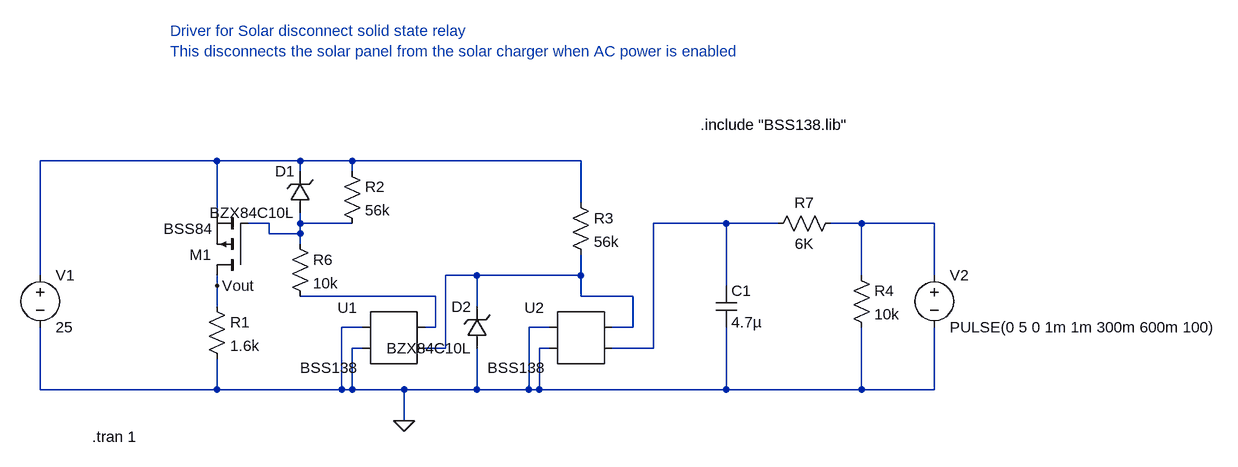
[diagram p0: schematic ndo-solar-switch.asc]
ndo-solar-switch.asc, the LTspice schematic file:
Version 4
SHEET 1 1392 768
WIRE -176 80 -448 80
WIRE -48 80 -176 80
WIRE 32 80 -48 80
WIRE 384 80 32 80
WIRE -48 96 -48 80
WIRE 32 96 32 80
WIRE 384 144 384 80
WIRE -176 160 -176 80
WIRE -96 176 -128 176
WIRE -48 176 -48 160
WIRE 32 176 -48 176
WIRE 608 176 496 176
WIRE 688 176 608 176
WIRE 816 176 768 176
WIRE 928 176 816 176
WIRE -96 192 -96 176
WIRE -48 192 -48 176
WIRE -48 192 -96 192
WIRE -48 208 -48 192
WIRE -448 256 -448 80
WIRE 224 256 176 256
WIRE 384 256 384 224
WIRE 384 256 224 256
WIRE 816 256 816 176
WIRE 928 256 928 176
WIRE -176 272 -176 256
WIRE 608 272 608 176
WIRE 160 288 -48 288
WIRE 384 288 384 256
WIRE 464 288 384 288
WIRE -176 304 -176 272
WIRE 224 304 224 256
WIRE 48 336 16 336
WIRE 160 336 160 288
WIRE 160 336 144 336
WIRE 336 336 304 336
WIRE 464 336 464 288
WIRE 464 336 432 336
WIRE 48 368 32 368
WIRE 176 368 176 256
WIRE 176 368 144 368
WIRE 336 368 320 368
WIRE 496 368 496 176
WIRE 496 368 432 368
WIRE -448 432 -448 336
WIRE -176 432 -176 384
WIRE -176 432 -448 432
WIRE 16 432 16 336
WIRE 16 432 -176 432
WIRE 32 432 32 368
WIRE 32 432 16 432
WIRE 112 432 32 432
WIRE 224 432 224 368
WIRE 224 432 112 432
WIRE 304 432 304 336
WIRE 304 432 224 432
WIRE 320 432 320 368
WIRE 320 432 304 432
WIRE 608 432 608 336
WIRE 608 432 320 432
WIRE 816 432 816 336
WIRE 816 432 608 432
WIRE 928 432 928 336
WIRE 928 432 816 432
WIRE 112 480 112 432
FLAG 112 480 0
FLAG -176 272 Vout
SYMBOL pmos -128 256 R180
SYMATTR InstName M1
SYMATTR Value BSS84
SYMBOL res -192 288 R0
SYMATTR InstName R1
SYMATTR Value 1.6k
SYMBOL res 368 128 R0
SYMATTR InstName R3
SYMATTR Value 56k
SYMBOL voltage -448 240 R0
WINDOW 123 0 0 Left 0
WINDOW 39 0 0 Left 0
SYMATTR InstName V1
SYMATTR Value 25
SYMBOL voltage 928 240 R0
WINDOW 123 0 0 Left 0
WINDOW 39 0 0 Left 0
SYMATTR InstName V2
SYMATTR Value PULSE(0 5 0 1m 1m 300m 600m 100)
SYMBOL res 800 240 R0
SYMATTR InstName R4
SYMATTR Value 10k
SYMBOL AutoGenerated\\BSS138 96 352 M0
SYMATTR InstName U1
SYMBOL AutoGenerated\\BSS138 384 352 M0
SYMATTR InstName U2
SYMBOL res -64 192 R0
SYMATTR InstName R6
SYMATTR Value 10k
SYMBOL res 784 160 R90
WINDOW 0 0 56 VBottom 2
WINDOW 3 32 56 VTop 2
SYMATTR InstName R7
SYMATTR Value 6K
SYMBOL cap 592 272 R0
SYMATTR InstName C1
SYMATTR Value 4.7µ
SYMBOL zener -32 160 R180
WINDOW 0 24 64 Left 2
WINDOW 3 24 0 Left 2
SYMATTR InstName D1
SYMATTR Value BZX84C10L
SYMBOL zener 240 368 R180
WINDOW 0 24 64 Left 2
WINDOW 3 24 0 Left 2
SYMATTR InstName D2
SYMATTR Value BZX84C10L
SYMBOL res 16 80 R0
SYMATTR InstName R2
SYMATTR Value 56k
TEXT 568 24 Left 2 !.include "BSS138.lib"
TEXT -368 504 Left 2 !.tran 1
TEXT -248 -120 Left 2 ;Driver for Solar disconnect solid state relay\nThis disconnects the solar panel from the solar charger when AC power is enabled

The netlist it stands for:
* ndo-solar-switch.asc
M1 Vout N002 N001 N001 BSS84
R1 Vout 0 1.6k
R3 N001 N005 56k
V1 N001 0 25
V2 N004 0 PULSE(0 5 0 1m 1m 300m 600m 100)
R4 N004 0 10k
* U1: BSS138 (symbol AutoGenerated\BSS138 not available, pins judged from their places): pin1=N006 pin2=N005 pin3=0 pin4=0
* U2: BSS138 (symbol AutoGenerated\BSS138 not available, pins judged from their places): pin1=N005 pin2=N003 pin3=0 pin4=0
R6 N002 N006 10k
R7 N004 N003 6K
C1 N003 0 4.7µ
D1 N002 N001 BZX84C10L
D2 0 N005 BZX84C10L
R2 N001 N002 56k
.model D D
.lib standard.dio
.model NMOS NMOS
.model PMOS PMOS
.lib standard.mos
.include "BSS138.lib"
.tran 1
* Driver for Solar disconnect solid state relay
* This disconnects the solar panel from the solar charger when AC power is enabled
.backanno
.end